# EAGLE schematic relay_timer (EAGLE 9.3.1)
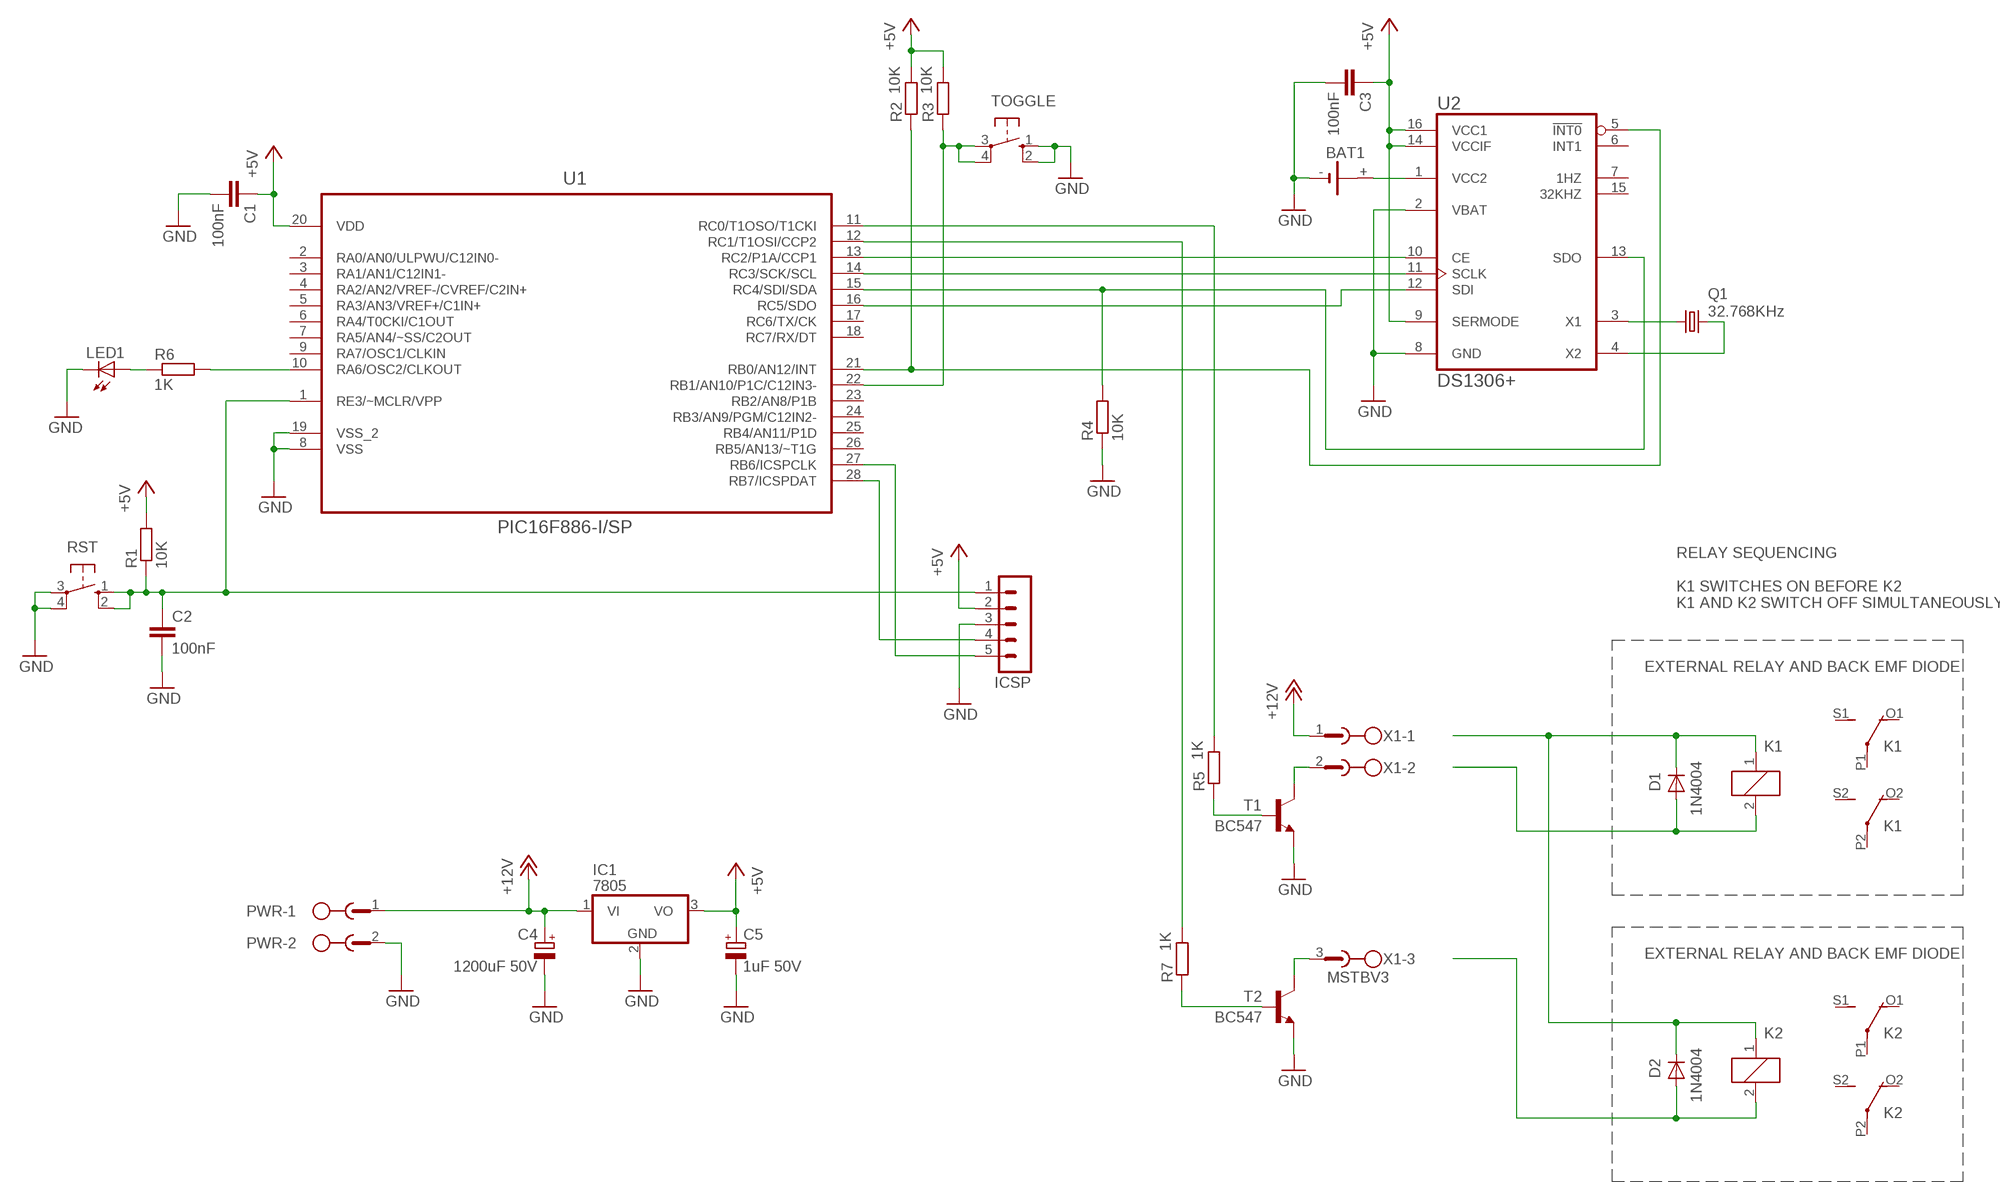
[diagram p0: schematic, sheet 1]

## Parts
BAT1  CR2032H  [CR2032H]
C1  100nF  C-EU050-025X075  [C050-025X075]
C2  100nF  C-EU050-025X075  [C050-025X075]
C3  100nF  C-EU050-025X075  [C050-025X075]
C4  1200uF 50V  CPOL-EUE3.5-8  [E3,5-8]
C5  1uF 50V  CPOL-EUE2-5  [E2-5]
D1  1N4004  [DO41-10]
D2  1N4004  [DO41-10]
IC1  7805  7805TV  [TO220V]
ICSP  MA05-1  [MA05-1]
K1  G2R2  [G2R2]
K2  G2R2  [G2R2]
LED1  LED3MM  [LED3MM]
PWR  MSTBV2  [MSTBV2]
Q1  32.768KHz  CRYSTALTC26H  [TC26H]
R1  10K  R-EU_0207/10  [0207/10]
R2  10K  R-EU_0207/10  [0207/10]
R3  10K  R-EU_0207/10  [0207/10]
R4  10K  R-EU_0207/10  [0207/10]
R5  1K  R-EU_0207/10  [0207/10]
R6  1K  R-EU_0207/10  [0207/10]
R7  1K  R-EU_0207/10  [0207/10]
RST  10-XX  [B3F-10XX]
T1  BC547  BC547A-NPN-TO92-CBE  [TO92-CBE]
T2  BC547  BC547A-NPN-TO92-CBE  [TO92-CBE]
TOGGLE  10-XX  [B3F-10XX]
U1  PIC16F886-I/SP  [DIL28-3]
U2  DS1306+  [DIL16]
X1  MSTBV3  [MSTBV3]

## Nets
+5V: C1.1 C3.1 C5.+ IC1.3(VO) ICSP.2 R1.2 R2.2 R3.2 U1.20(VDD) U2.9(SERMODE) U2.14(VCCIF) U2.16(VCC1)
+12V: C4.+ IC1.1(VI) PWR.1 X1.1
GND: BAT1.- C1.2 C2.2 C3.2 C4.- C5.- IC1.2(GND) ICSP.3 LED1.K(C) PWR.2 R4.1 RST.3(P) RST.4(P1) T1.E T2.E TOGGLE.1(S) TOGGLE.2(S1) U1.8(VSS) U1.19(VSS_2) U2.2(VBAT) U2.8(GND)
N$1: U1.16(RC5/SDO) U2.12(SDI)
N$2: R4.2 U1.15(RC4/SDI/SDA) U2.13(SDO)
N$3: U1.14(RC3/SCK/SCL) U2.11(SCLK)
N$4: R2.1 U1.21(RB0/AN12/INT) U2.5(!INT0!)
N$5: Q1.1 U2.3(X1)
N$6: Q1.2 U2.4(X2)
N$7: C2.1 ICSP.1 R1.1 RST.1(S) RST.2(S1) U1.1(RE3/~MCLR/VPP)
N$8: U1.13(RC2/P1A/CCP1) U2.10(CE)
N$9: LED1.A R6.1
N$10: R5.2 U1.11(RC0/T1OSO/T1CKI)
N$11: R5.1 T1.B
N$12: ICSP.4 U1.28(RB7/ICSPDAT)
N$13: ICSP.5 U1.27(RB6/ICSPCLK)
N$14: T1.C X1.2
N$15: R6.2 U1.10(RA6/OSC2/CLKOUT)
N$16: R7.2 U1.12(RC1/T1OSI/CCP2)
N$17: BAT1.+ U2.1(VCC2)
N$18: R3.1 TOGGLE.3(P) TOGGLE.4(P1) U1.22(RB1/AN10/P1C/C12IN3-)
N$19: D1.A K1.2
N$20: R7.1 T2.B
N$21: T2.C X1.3
N$22: D1.C D2.C K1.1 K2.1
N$23: D2.A K2.2
Unconnected: BAT1.+@1(+) K1.O1(2:O) K1.O2(3:O) K1.P1(2:P) K1.P2(3:P) K1.S1(2:S) K1.S2(3:S) K2.O1(2:O) K2.O2(3:O) K2.P1(2:P) K2.P2(3:P) K2.S1(2:S) K2.S2(3:S) U1.2(RA0/AN0/ULPWU/C12IN0-) U1.3(RA1/AN1/C12IN1-) U1.4(RA2/AN2/VREF-/CVREF/C2IN+) U1.5(RA3/AN3/VREF+/C1IN+) U1.6(RA4/T0CKI/C1OUT) U1.7(RA5/AN4/~SS/C2OUT) U1.9(RA7/OSC1/CLKIN) U1.17(RC6/TX/CK) U1.18(RC7/RX/DT) U1.23(RB2/AN8/P1B) U1.24(RB3/AN9/PGM/C12IN2-) U1.25(RB4/AN11/P1D) U1.26(RB5/AN13/~T1G) U2.6(INT1) U2.7(1HZ) U2.15(32KHZ)

## Notes on the sheet
- RELAY SEQUENCING
  
  K1 SWITCHES ON BEFORE K2
  K1 AND K2 SWITCH OFF SIMULTANEOUSLY
- EXTERNAL RELAY AND BACK EMF DIODE
- EXTERNAL RELAY AND BACK EMF DIODE

## Library data of the parts
BAT1 = battery:CR2032H: LI BATTERY Varta
C1-C3 = rcl:C-EU: CAPACITOR, European symbol
C4 C5 = rcl:CPOL-EU: POLARIZED CAPACITOR, European symbol
D1 D2 = diode:1N4004: DIODE general purpose rectifier, 1 A
IC1 = linear:78*: Positive VOLTAGE REGULATOR Source: http://cache.national.com/ds/LM/LM78L05.pdf http://www.fairchildsemi.com/ds/LM/LM7805.pdf
ICSP = con-lstb:MA05-1: PIN HEADER; OC_FARNELL: unknown; OC_NEWARK: unknown
K1 K2 = relay:G2R2: RELAY 2 x switch, Omron; MF: OMRON COMPONENTS USA; MPN: G2R-2-DC6; OC_FARNELL: unknown; OC_NEWARK: 89C5317
LED1 = led:LED: LED OSRAM: - CHIPLED LG R971, LG N971, LY N971, LG Q971, LY Q971, LO R971, LY R971 LH N974, LH R974 LS Q976, LO Q976, LY Q976 LO Q996 - Hyper CHIPLED LW Q18S LB Q993, LB Q99A, LB R99A - SideLED LS A670, LO A670, LY A670, LG A670, LP A670 LB A673, LV A673, LT A673, LW A673 LH A674 LY A675 LS A676, LA A676, LO A676, LY A676, LW A676 LS A679, LY A679, LG A679 - Hyper Micro SIDELED® LS Y876, LA Y876, LO Y876, LY Y876 LT Y87S - SmartLED LW L88C, LW L88S LB L89C, LB L89S, LG L890 LS L89K, LO L89K, LY L89K LS L896, LA L896, LO L896, LY L896 - TOPLED LS T670, LO T670, LY T670, LG T670, LP T670 LSG T670, LSP T670, LSY T670, LOP T670, LYG T670 LG T671, LOG T671, LSG T671 LB T673, LV T673, LT T673, LW T673 LH T674 LS T676, LA T676, LO T676, LY T676, LB T676, LH T676, LSB T676, LW T676 LB T67C, LV T67C, LT T67C, LS T67K, LO T67K, LY T67K, LW E67C LS E67B, LA E67B, LO E67B, LY E67B, LB E67C, LV E67C, LT E67C LW T67C LS T679, LY T679, LG T679 LS T770, LO T770, LY T770, LG T770, LP T770 LB T773, LV T773, LT T773, LW T773 LH T774 LS E675, LA E675, LY E675, LS T675 LS T776, LA T776, LO T776, LY T776, LB T776 LHGB T686 LT T68C, LB T68C - Hyper Mini TOPLED® LB M676 - Mini TOPLED Santana® LG M470 LS M47K, LO M47K, LY M47K Source: http://www.osram.convergy.de LUXEON: - LUMILED® LXK2-PW12-R00, LXK2-PW12-S00, LXK2-PW14-U00, LXK2-PW14-V00 LXK2-PM12-R00, LXK2-PM12-S00, LXK2-PM14-U00 LXK2-PE12-Q00, LXK2-PE12-R00, LXK2-PE12-S00, LXK2-PE14-T00, LXK2-PE14-U00 LXK2-PB12-K00, LXK2-PB12-L00, LXK2-PB12-M00, LXK2-PB14-N00, LXK2-PB14-P00, LXK2-PB14-Q00 LXK2-PR12-L00, LXK2-PR12-M00, LXK2-PR14-Q00, LXK2-PR14-R00 LXK2-PD12-Q00, LXK2-PD12-R00, LXK2-PD12-S00 LXK2-PH12-R00, LXK2-PH12-S00 LXK2-PL12-P00, LXK2-PL12-Q00, LXK2-PL12-R00 Source: www.luxeon.com KINGBRIGHT: KA-3528ASYC Source: www.kingbright.com
PWR = con-phoenix-508:MSTBV2: PHOENIX; MPN: MSTBV 2,5/2-GF-5.08; OC_FARNELL: 1792792; OC_NEWARK: 69R9845
Q1 = crystal:CRYSTAL: CRYSTAL; OC_FARNELL: unknown; OC_NEWARK: unknown
R1-R7 = rcl:R-EU_: RESISTOR, European symbol
RST TOGGLE = switch-omron:10-XX: OMRON SWITCH; MPN: B3F-1000; OC_FARNELL: 176432; OC_NEWARK: 36M3542
T1 T2 = transistor:*-NPN-: NPN Transistror BF959 corrected 2008.03.06
U1 = relay_timer:PIC16F886-I/SP: 8-Bit CMOS Microcontrollers
U2 = relay_timer:DS1306+
X1 = con-phoenix-508:MSTBV3: PHOENIX; MPN: MSTBV 2,5/3-GF-5.08; OC_FARNELL: 1792793; OC_NEWARK: 69R9846